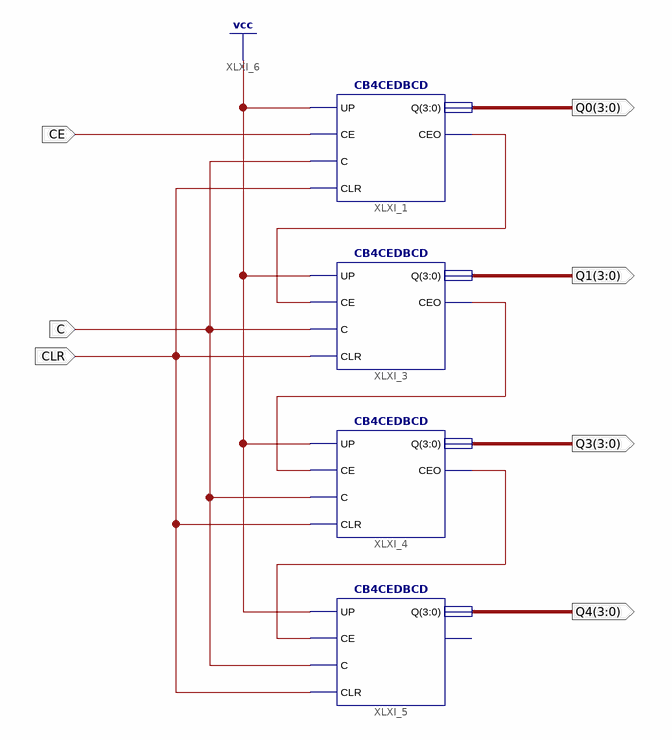
[diagram p0: schematic sheet 1]
// Xilinx ISE schematic CB4CEDBCDx4.sch (spartan3e) as structural Verilog: 4 symbols, 7 ports
module CB4CEDBCDx4 (
  input  C,
  input  CE,
  input  CLR,
  output [3:0] Q4,
  output [3:0] Q3,
  output [3:0] Q1,
  output [3:0] Q0
);

  wire XLXN_1, XLXN_2, XLXN_3;

  CB4CEDBCD XLXI_1 (.C(C), .CE(CE), .CEO(XLXN_1), .CLR(CLR), .Q(Q0), .UP(1'b1));
  CB4CEDBCD XLXI_3 (.C(C), .CE(XLXN_1), .CEO(XLXN_2), .CLR(CLR), .Q(Q1), .UP(1'b1));
  CB4CEDBCD XLXI_4 (.C(C), .CE(XLXN_2), .CEO(XLXN_3), .CLR(CLR), .Q(Q3), .UP(1'b1));
  CB4CEDBCD XLXI_5 (.C(C), .CE(XLXN_3), .CLR(CLR), .Q(Q4), .UP(1'b1));  // open: CEO
endmodule
